# EAGLE design batu (EAGLE 9.2.2)
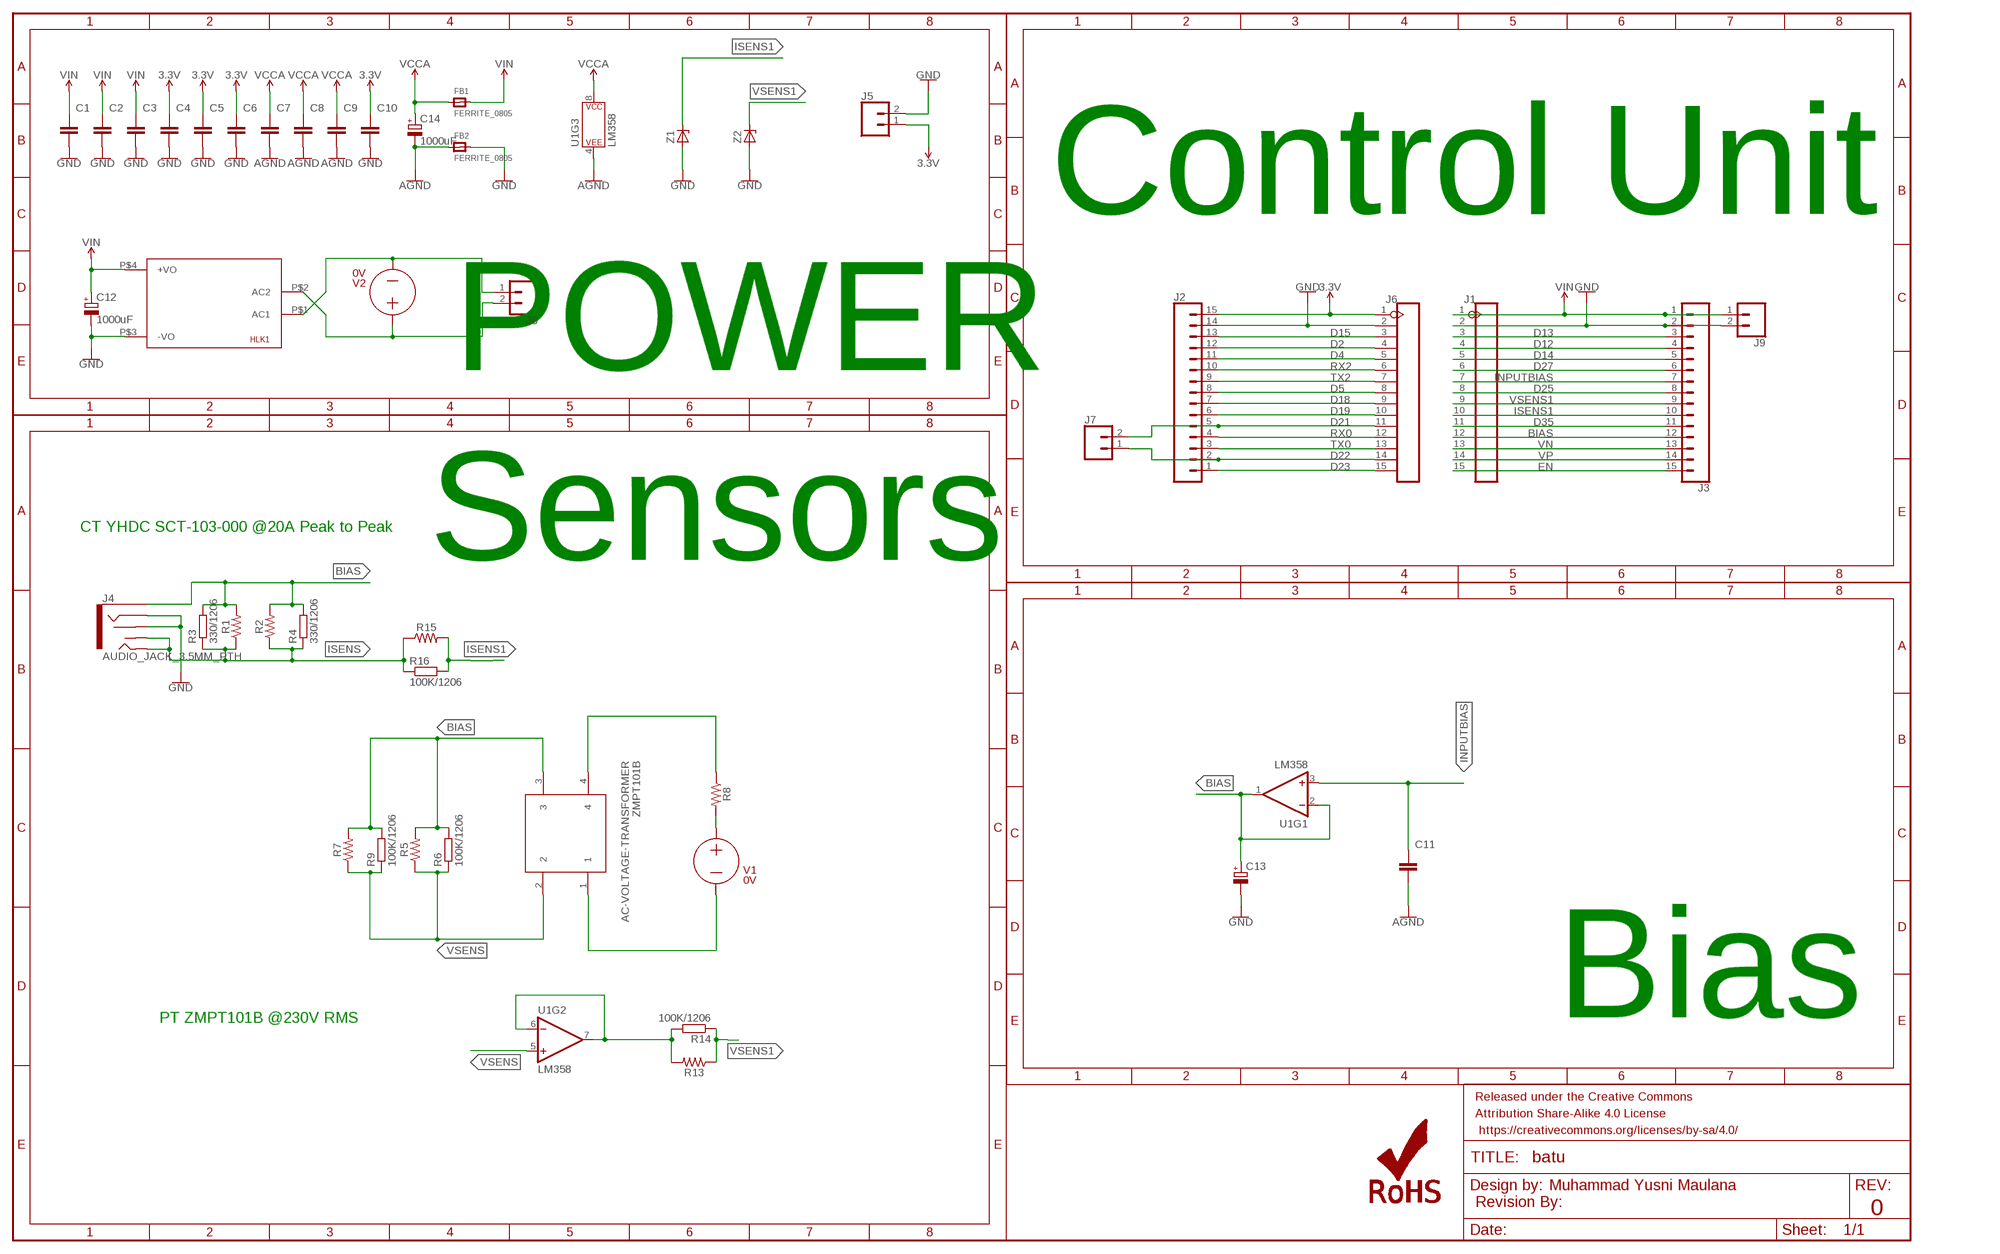
[diagram p0: schematic, sheet 1]

## Parts
C1  0.1uF  C-EUC1206  [C1206]
C2  10uF  C-EUC1206  [C1206]
C3  0.1uF  C-EUC1206  [C1206]
C4  0.1uF  C-EUC1206  [C1206]
C5  10uF  C-EUC1206  [C1206]
C6  0.1uF  C-EUC1206  [C1206]
C7  0.1uF  C-EUC1206  [C1206]
C8  10uF  C-EUC1206  [C1206]
C9  10uF  C-EUC1206  [C1206]
C10  0.1uF  C-EUC1206  [C1206]
C11  10uF  C-EUC1206  [C1206]
C12  1000uF  CPOL-EUSANYO_C6  [SANYO-OSCON_C6]
C13  CPOL-EUSANYO_C6  [SANYO-OSCON_C6]
C14  1000uF  CPOL-EUSANYO_C6  [SANYO-OSCON_C6]
FB1  FERRITE_0805  [_0805]
FB2  FERRITE_0805  [_0805]
FRAME1  FRAME-LEDGER  [CREATIVE_COMMONS]
HLK1  HLK-PM013W  [HLK-PM01]
J1  HEADER-15P2.54  [15P-2.54]
J2  CONN_15  [1X15]
J3  CONN_15  [1X15]
J4  AUDIO_JACK_3.5MM_PTH  [AUDIO-JACK]
J5  CONN_021X02_NO_SILK  [1X02_NO_SILK]
J6  HEADER-15P2.54  [15P-2.54]
J7  CONN_021X02_NO_SILK  [1X02_NO_SILK]
J8  CONN_025MM  [SCREWTERMINAL-5MM-2]
J9  CONN_021X02_NO_SILK  [1X02_NO_SILK]
LOGO3  REVISION  [REVISION]
LOGO8  ROHS_LOGO  [ROHS_LOGO_0.18_IN]
R1  RESISTORAXIAL-0.3  [AXIAL-0.3]
R2  RESISTORAXIAL-0.3  [AXIAL-0.3]
R3  330/1206  R-EU_R1206  [R1206]
R4  330/1206  R-EU_R1206  [R1206]
R5  RESISTORAXIAL-0.3  [AXIAL-0.3]
R6  100K/1206  R-EU_R1206  [R1206]
R7  RESISTORAXIAL-0.3  [AXIAL-0.3]
R8  RESISTORAXIAL-0.3  [AXIAL-0.3]
R9  100K/1206  R-EU_R1206  [R1206]
R13  RESISTORAXIAL-0.3  [AXIAL-0.3]
R14  100K/1206  R-EU_R1206  [R1206]
R15  RESISTORAXIAL-0.3  [AXIAL-0.3]
R16  100K/1206  R-EU_R1206  [R1206]
U1  LM358  LM358KIT  [DIL08]
V1  0V  VOLTAGE  (no package)
V2  0V  VOLTAGE  (no package)
Z1  ZENER-DIODESOD80C  [SOD80C]
Z2  ZENER-DIODESOD80C  [SOD80C]
ZMPT101B  AC-VOLTAGE-TRANSFORMER  AC-VOLTAGE-SENSOR  [AC-VOLTAGE-SENSOR]

## Nets
3.3V: C4.1 C5.1 C6.1 C10.1 J2.15 J5.1 J6.1
AGND: C7.2 C8.2 C9.2 C11.2 C14.- FB2.1 U1.4(P$V-)
BIAS: C13.+ J1.12 J3.12 J4.SLEEVE R1.P$2 R2.P$2 R3.2 R4.2 R5.P$2 R6.2 R7.P$2 R9.2 U1.1(OUT) U1.2(-IN) ZMPT101B.3
D2: J2.12 J6.4
D4: J2.11 J6.5
D5: J2.8 J6.8
D12: J1.4 J3.4
D13: J1.3 J3.3
D14: J1.5 J3.5
D15: J2.13 J6.3
D18: J2.7 J6.9
D19: J2.6 J6.10
D21: J2.5 J6.11 J7.2
D22: J2.2 J6.14 J7.1
D23: J2.1 J6.15
D25: J1.8 J3.8
D27: J1.6 J3.6
D35: J1.11 J3.11
EN: J1.15 J3.15
GND: C1.2 C2.2 C3.2 C4.2 C5.2 C6.2 C10.2 C12.- C13.- FB2.2 HLK1.P$3(-VO) J1.2 J2.14 J3.2 J4.RING J4.RSH J5.2 J6.2 J9.2 Z1.A Z2.A
INPUTBIAS: C11.1 J1.7 J3.7 U1.3(+IN)
ISENS: J4.TIP J4.TSH R1.P$1 R2.P$1 R3.1 R4.1 R15.P$1 R16.1
ISENS1: J1.10 J3.10 R15.P$2 R16.2 Z1.C
L: HLK1.P$2(AC2) J8.2 R8.P$2 V1.+ V2.+
N: HLK1.P$1(AC1) J8.1 V1.- V2.- ZMPT101B.1
N$8: R8.P$1 ZMPT101B.4
RX0: J2.4 J6.12
RX2: J2.10 J6.6
TX0: J2.3 J6.13
TX2: J2.9 J6.7
VCCA: C7.1 C8.1 C9.1 C14.+ FB1.1 U1.8(P$V+)
VIN: C1.1 C2.1 C3.1 C12.+ FB1.2 HLK1.P$4(+VO) J1.1 J3.1 J9.1
VN: J1.13 J3.13
VP: J1.14 J3.14
VSENS: R5.P$1 R6.1 R7.P$1 R9.1 U1.5(+IN) ZMPT101B.2
VSENS1: J1.9 J3.9 R13.P$1 R14.1 Z2.C
VSENS2: R13.P$2 R14.2 U1.6(-IN) U1.7(OUT)

## Notes on the sheet
- Control Unit
- POWER
- Sensors
- CT YHDC SCT-103-000 @20A Peak to Peak
- Bias
- PT ZMPT101B @230V RMS
- Muhammad Yusni Maulana
- 0

## Library data of the parts
C1-C11 = for the universe:C-EU: CAPACITOR, European symbol; SPICEPREFIX: C
C12-C14 = for the universe:CPOL-EU: POLARIZED CAPACITOR, European symbol; SPICEPREFIX: C
FB1 FB2 = for the universe:FERRITE
FRAME1 = for the universe:FRAME-LEDGER: Schematic Frame - Ledger Standard 11x14 US Ledger frame
HLK1 = for the universe:HLK-PM01: Hi-Link Power Supply HLK-PM01 3W Author: Ahmed Said <https://github.com/AhmedSaid/EAGLELibraries>
J1 J6 = for the universe:HEADER-15P: Header 15 Standard 15-pin 0.1" header. Use with straight break away headers (SKU : PRT-00116), right angle break away headers (PRT-00553), swiss pins (PRT-00743), machine pins (PRT-00117), and female headers (PRT-00115).
J2 J3 = for the universe:CONN_15: Multi connection point. Often used as Generic Header-pin footprint for 0.1 inch spaced/style header connections On any of the 0.1 inch spaced packages, you can populate with these: Break Away Headers - Straight <https://www.sparkfun.com/products/116> (PRT-00116) Break Away Male Headers - Right Angle <https://www.sparkfun.com/products/553> (PRT-00553) Female Headers <https://www.sparkfun.com/products/115> (PRT-00115) Break Away Headers - Machine Pin <https://www.sparkfun.com/products/117> (PRT-00117) Break Away Female Headers - Swiss Machine Pin <https://www.sparkfun.com/products/743> (PRT-00743) For SCREWTERMINALS and SPRING TERMINALS visit here: Screw Terimnals on SparkFun.com <https://www.sparkfun.com/search/results?term=Screw+Terminals> (5mm/3.5mm/2.54mm spacing) This device is also useful as a general connection point to wire up your design to another part of your project. Our various solder wires solder well into these plated through hole pads. Hook-Up Wire - Assortment (Stranded, 22 AWG) <https://www.sparkfun.com/products/11375> (PRT-11375) Hook-Up Wire - Assortment (Solid Core, 22 AWG) <https://www.sparkfun.com/products/11367> (PRT-11367) View the entire wire category on our website here <https://www.sparkfun.com/categories/141> Special notes: Molex polarized connector foot print use with SKU : PRT-08231 with associated crimp pins and housings. 1MM SMD Version SKU: PRT-10208 NOTES ON THE VARIANTS LOCK and LOCK_LONGPADS... This footprint was designed to help hold the alignment of a through-hole component (i.e. 6-pin header) while soldering it into place. You may notice that each hole has been shifted either up or down by 0.005 of an inch from it's more standard position (which is a perfectly straight line). This slight alteration caused the pins (the squares in the middle) to touch the edges of the holes. Because they are alternating, it causes a "brace" to hold the component in place. 0.005 has proven to be the perfect amount of "off-center" position when using our standard breakaway headers. Although looks a little odd when you look at the bare footprint, once you have a header in there, the alteration is very hard to notice. Also,if you push a header all the way into place, it is covered up entirely on the bottom side.
J4 = for the universe:AUDIO_JACK_3.5MM: Audio Jack 3.5mm variants of PTH and SMT stereo audio jack with bypass switches. SparkFun Products: SparkFun SparkPunk Sound Kit <[https://www.sparkfun.com/products/11177]> - PTH MP3 Trigger <https://www.sparkfun.com/products/13720> -3.5mm SMD SparkFun PicoBoard <https://www.sparkfun.com/products/11888>- 2.5mm SMD; PROD_ID: CONN-08774; SF_ID: PRT-08032
J5 J7 J9 = for the universe:CONN_02: Multi connection point. Often used as Generic Header-pin footprint for 0.1 inch spaced/style header connections On any of the 0.1 inch spaced packages, you can populate with these: Break Away Headers - Straight <https://www.sparkfun.com/products/116> (PRT-00116) Break Away Male Headers - Right Angle <https://www.sparkfun.com/products/553> (PRT-00553) Female Headers <https://www.sparkfun.com/products/115> (PRT-00115) Break Away Headers - Machine Pin <https://www.sparkfun.com/products/117> (PRT-00117) Break Away Female Headers - Swiss Machine Pin <https://www.sparkfun.com/products/743> (PRT-00743) For SCREWTERMINALS and SPRING TERMINALS visit here: Screw Terimnals on SparkFun.com <https://www.sparkfun.com/search/results?term=Screw+Terminals> (5mm/3.5mm/2.54mm spacing) This device is also useful as a general connection point to wire up your design to another part of your project. Our various solder wires solder well into these plated through hole pads. Hook-Up Wire - Assortment (Stranded, 22 AWG) <https://www.sparkfun.com/products/11375> (PRT-11375) Hook-Up Wire - Assortment (Solid Core, 22 AWG) <https://www.sparkfun.com/products/11367> (PRT-11367) View the entire wire category on our website here <https://www.sparkfun.com/categories/141> Special notes: Molex polarized connector foot print use with: PRT-08233 with associated crimp pins and housings. 2.54_SCREWTERM for use with PRT-10571. 3.5mm Screw Terminal footprints for PRT-08084 5mm Screw Terminal footprints for use with PRT-08432
J8 = for the universe:CONN_02: Multi connection point. Often used as Generic Header-pin footprint for 0.1 inch spaced/style header connections On any of the 0.1 inch spaced packages, you can populate with these: Break Away Headers - Straight <https://www.sparkfun.com/products/116> (PRT-00116) Break Away Male Headers - Right Angle <https://www.sparkfun.com/products/553> (PRT-00553) Female Headers <https://www.sparkfun.com/products/115> (PRT-00115) Break Away Headers - Machine Pin <https://www.sparkfun.com/products/117> (PRT-00117) Break Away Female Headers - Swiss Machine Pin <https://www.sparkfun.com/products/743> (PRT-00743) For SCREWTERMINALS and SPRING TERMINALS visit here: Screw Terimnals on SparkFun.com <https://www.sparkfun.com/search/results?term=Screw+Terminals> (5mm/3.5mm/2.54mm spacing) This device is also useful as a general connection point to wire up your design to another part of your project. Our various solder wires solder well into these plated through hole pads. Hook-Up Wire - Assortment (Stranded, 22 AWG) <https://www.sparkfun.com/products/11375> (PRT-11375) Hook-Up Wire - Assortment (Solid Core, 22 AWG) <https://www.sparkfun.com/products/11367> (PRT-11367) View the entire wire category on our website here <https://www.sparkfun.com/categories/141> Special notes: Molex polarized connector foot print use with: PRT-08233 with associated crimp pins and housings. 2.54_SCREWTERM for use with PRT-10571. 3.5mm Screw Terminal footprints for PRT-08084 5mm Screw Terminal footprints for use with PRT-08432; SF_SKU: PRT-08432
LOGO3 = SparkFun-Aesthetics:REVISION: "Revision By" Text Preceding text for revisor documentation. Includes schematic text on "symbols" layer, and board text on tDoc.
LOGO8 = for the universe:ROHS_LOGO: Restriction of Hazardous Substances (RoHS) Logo Logo for RoHS-certified hardware.
R1 R2 R5 R7 R8 R13 R15 = for the universe:RESISTOR: Generic Resistor Package
R3 R4 R6 R9 R14 R16 = for the universe:R-EU_: RESISTOR, European symbol; SPICEPREFIX: R
U1 = for the universe:LM358: LM358 Jellybean op-amp Datasheet <http://www.sparkfun.com/datasheets/Components/General/LM358.pdf> SparkFun Products Op-Amp (Thru-Hole) - LM358 <https://www.sparkfun.com/products/9456> (COM-09456); PROD_ID: IC-09172; SPICEPREFIX: U
V1 V2 = for the universe:VOLTAGE: Independent Voltage Source, either DC, AC, PULSE, SINE, PWL, EXP, or SFFM
Z1 Z2 = for the universe:ZENER-DIODE: Z-Diode
ZMPT101B = for the universe:AC-VOLTAGE-SENSOR: ZMPT101B transformer

## Net classes
0 default: clearance 0.3 mm

## Board
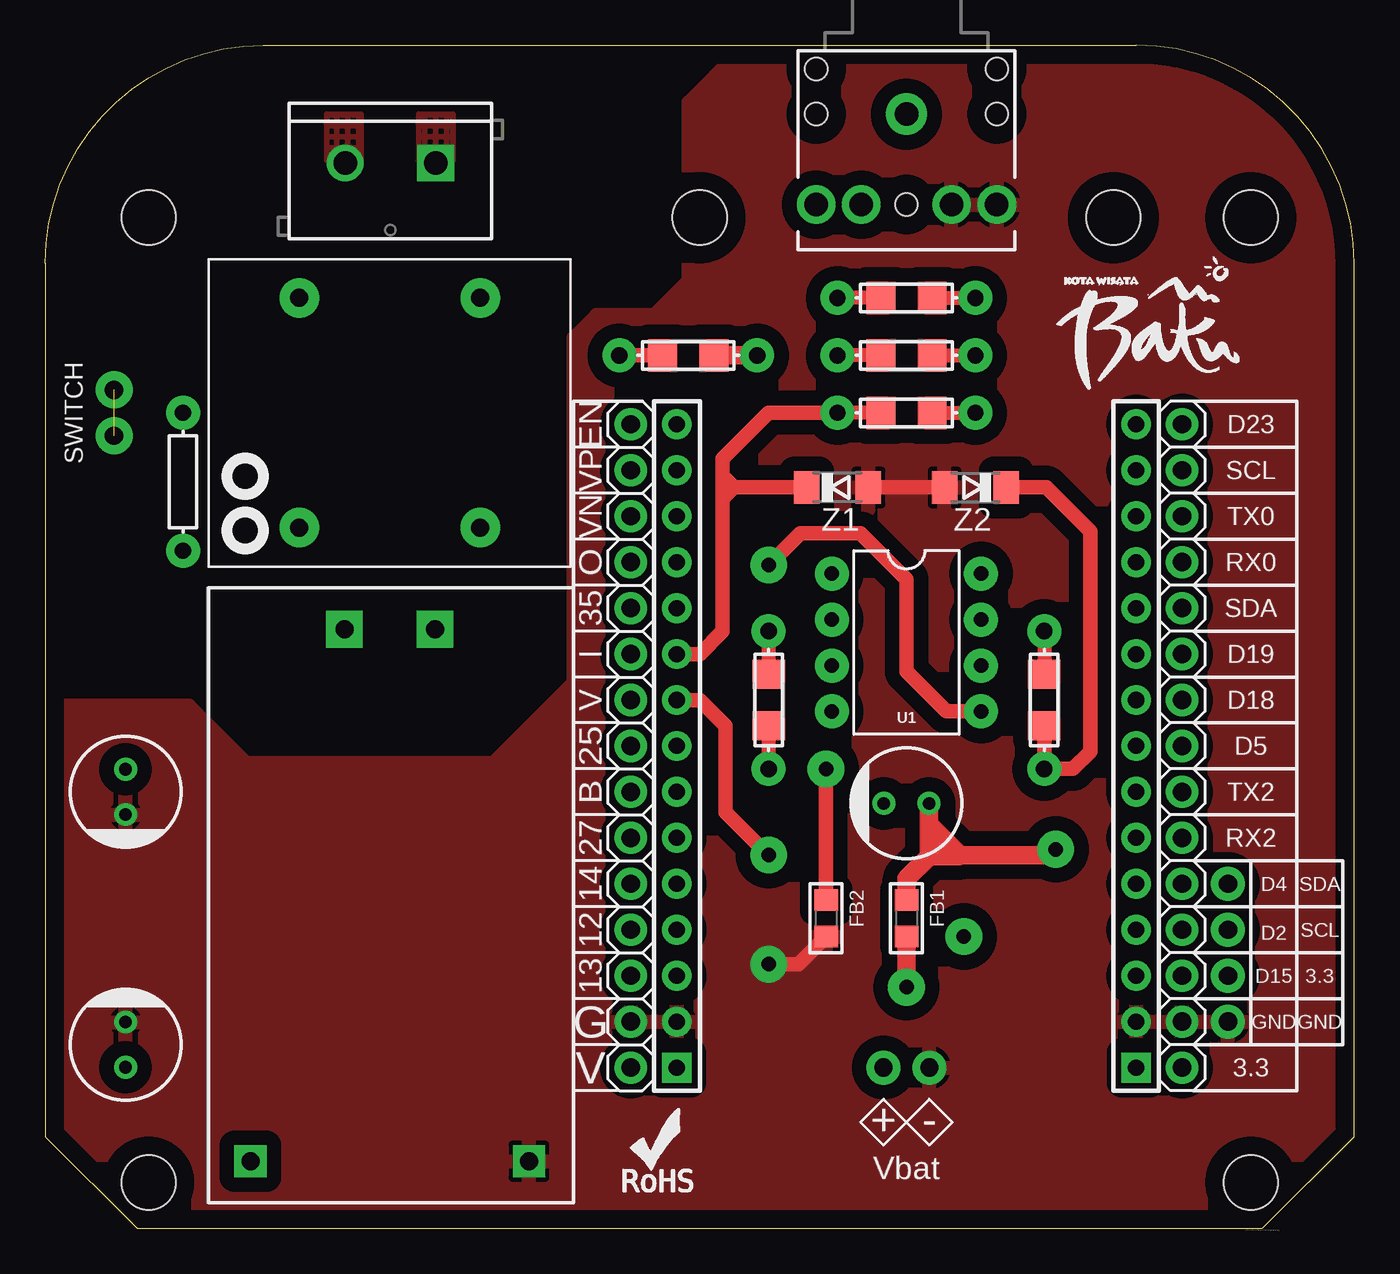
[diagram p1: board, top side]
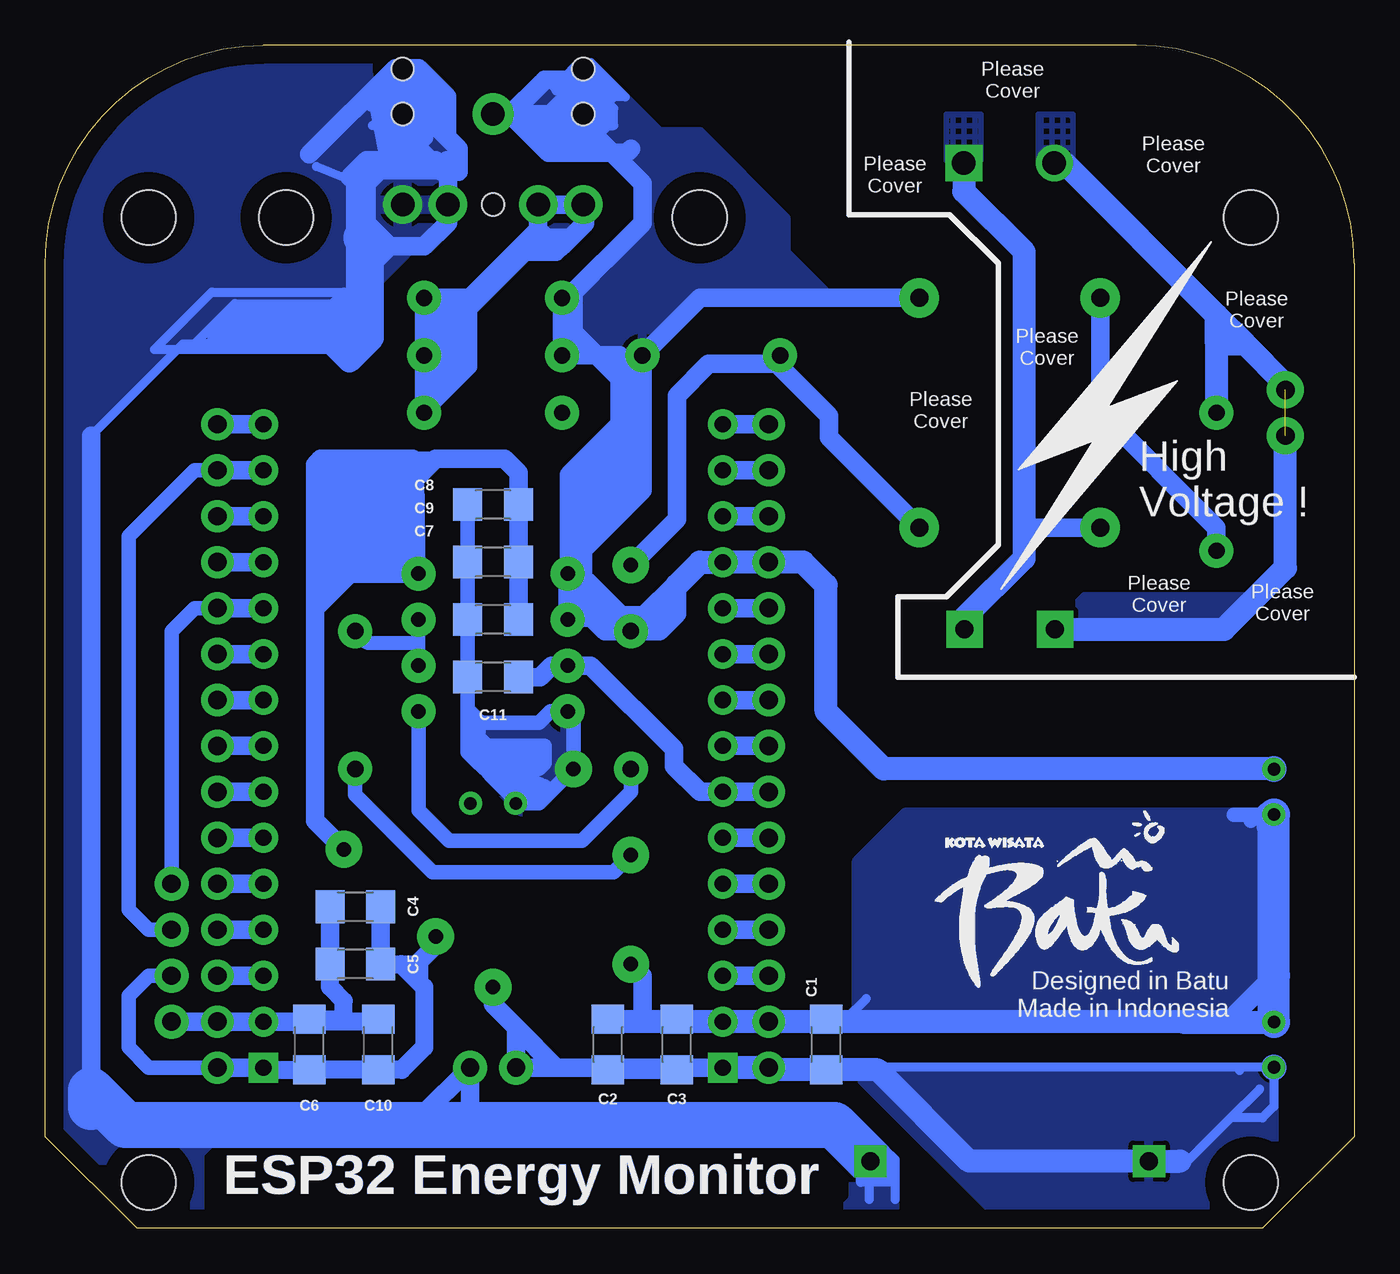
[diagram p2: board, bottom side, seen from below]

Size 72.39 x 65.41 mm. Coordinates in mm from the lower left corner, seen from the top.
Outline: 0,53.34 0,5.08 5.08,0 67.31,0 72.39,5.08 72.39,53.34 arc90 60.33,65.41 12.07,65.41 arc90 0,53.34
Copper layers (1*16): Top 0.035mm / dielectric 1.5mm / Bottom 0.035mm
Design rules "default *": minimum track width 6mil, minimum drill 0.35mm, track to track 6mil, track to pad 6mil, pad to pad 6mil, via to via 6mil, smd to smd 6mil, copper to edge 40mil, drill to drill 6mil, minimum pad ring 10mil, minimum via ring 8mil, stop-mask expansion 4mil, vias tented up to drill 0mil, thermal gap 10mil
Holes 3 mm at 66.67,2.54 5.72,2.54 5.72,55.88 36.2,55.88 59.05,55.88 66.67,55.88

### Footprints (pad centres in the part's own frame; a part is rotated, then mirrored left to right if it is on the bottom)
C1206 = smd 1.6 x 1.8: 1 -1.4,0; 2 1.4,0
SANYO-OSCON_C6 = drill 0.7 pad 1.27: + 1.25,0; - -1.25,0
_0805 = smd 1.2 x 1.3: 1 -1.016,0; 2 1.016,0
HLK-PM01 = drill 1 pad 2.032 square: P$1 -14.7,2.5; P$2 -14.7,-2.5 | drill 1 pad 1.778 square: P$3 14.7,7.7; P$4 14.7,-7.7
15P-2.54 = drill 0.889 pad 1.651 square: 1 -17.78,0 | drill 0.889 pad 1.651: 2 -15.24,0; 3 -12.7,0; 4 -10.16,0; 5 -7.62,0; 6 -5.08,0; 7 -2.54,0; 8 0,0; 9 2.54,0; 10 5.08,0; 11 7.62,0; 12 10.16,0; 13 12.7,0; 14 15.24,0; 15 17.78,0
1X15 = drill 1.016 pad 1.778: 1 0,0; 2 2.54,0; 3 5.08,0; 4 7.62,0; 5 10.16,0; 6 12.7,0; 7 15.24,0; 8 17.78,0; 9 20.32,0; 10 22.86,0; 11 25.4,0; 12 27.94,0; 13 30.48,0; 14 33.02,0; 15 35.56,0
AUDIO-JACK = drill 1.3 pad 2.134: RING 5,5; RSH 5,2.5; TIP 5,-5; TSH 5,-2.5 | drill 1.3 pad 2.286: SLEEVE 0,0 | hole 1.25: 0,5; -2.5,5; -2.5,-5; 0,-5; 5,0
1X02_NO_SILK = drill 1.016 pad 1.88: 1 0,0; 2 2.54,0
SCREWTERMINAL-5MM-2 = drill 1.3 pad 2.032 square: 1 0,0 | drill 1.3 pad 2.032: 2 5,0
AXIAL-0.3 = drill 0.9 pad 1.88: P$1 -3.81,0; P$2 3.81,0
R1206 = smd 1.6 x 1.803: 1 -1.422,0; 2 1.422,0
DIL08 = drill 0.813 pad 1.88: 1 -3.81,-4.128; 2 -1.27,-4.128; 3 1.27,-4.128; 4 3.81,-4.128; 5 3.81,4.128; 6 1.27,4.128; 7 -1.27,4.128; 8 -3.81,4.128
SOD80C = smd 1.4 x 1.8: A 1.7,0; C -1.7,0
AC-VOLTAGE-SENSOR = drill 1 pad 2.184: 1 5,6.35; 2 -5,6.35; 3 -5,-6.35; 4 5,-6.35

### Placement (x,y rotation side)
C1  29.21,10.16 90 bottom
C2  41.28,10.16 90 bottom
C3  37.47,10.16 90 bottom
C4  55.25,17.78 180 bottom
C5  55.25,14.61 180 bottom
C6  57.79,10.16 90 bottom
C7  47.62,33.66 180 bottom
C8  47.62,40.01 180 bottom
C9  47.62,36.83 180 bottom
C10  53.98,10.16 90 bottom
C11  47.62,30.48 180 bottom
C12  4.45,10.16 270 top
C13  4.45,24.13 90 top
C14  47.62,23.5 0 top
FB1  47.62,17.14 270 top
FB2  43.18,17.14 270 top
FRAME1  14.29,-25.08 0 top  (outside the outline)
HLK1  19.05,18.41 270 top
J1  34.93,26.67 90 top
J2  62.87,44.45 270 top
J3  32.39,8.89 90 top
J4  47.62,61.59 270 top
J5  65.41,13.97 270 top
J6  60.33,26.67 90 top
J7  65.41,16.51 90 top
J8  21.59,58.9 180 top
J9  46.36,8.89 0 top
LOGO3  26.67,-27.94 0 top  (outside the outline)
LOGO8  31.75,1.91 0 top
R1  47.62,51.44 180 top
R2  47.62,48.26 180 top
R3  47.62,51.44 180 top
R4  47.62,48.26 180 top
R5  40.01,29.21 90 top
R6  40.01,29.21 90 top
R7  35.56,48.26 0 top
R8  7.62,41.27 90 top
R9  35.56,48.26 0 top
R13  55.25,29.21 90 top
R14  55.25,29.21 90 top
R15  47.62,45.09 180 top
R16  47.62,45.09 180 top
U1  47.62,32.38 270 top
Z1  43.81,40.96 0 top
Z2  51.44,40.96 180 top
ZMPT101B  19.05,45.09 180 top

### Tracks (layer width: path | path; a pad name or v marks a point on that pad's centre or on a via)
3.3V  (via drill 0.8 pad 2.03)
  Bottom 0.508: 51.44,13.34 51.44,15.03 51.33,15.13 | J6.1 60.2,8.76 58.42,8.76
  Bottom 0.762: 57.92,8.89 C6.1
  Bottom 0.813: J2.15 66.67,8.89 67.79,10 67.79,12.86 66.67,13.97 J5.1
  Bottom 1: v50.8,16.14 50.56,15.9 51.33,15.13 51.86,14.61 C5.1 52.7,14.61 51.44,13.34 51.44,10 52.68,8.76 C10.1 C6.1 58.42,8.76 60.33,8.76
  Bottom 1.016: C4.1 C5.1 | J2.15 60.45,8.89 60.33,8.76
AGND  (via drill 0.8 pad 2.03)
  Top 0.813: FB2.1 v43.18,25.4
  Bottom 0.813: C8.2 C9.2 C7.2 C11.2 49.03,28.7 | 43.43,25.65 v43.18,25.4 | 48.58,28.26 48.26,27.94 45.09,27.94 44.45,28.57 U1.4 43.18,28.32 v43.18,25.4 | 48.58,28.26 49.03,28.7 | 45.72,25.4 45.09,25.4 44.77,25.72 44.77,26.35 | 45.72,25.4 48.1,25.4 | 48.1,25.4 48.58,25.88 | 48.58,25.88 49.03,26.32 49.03,28.7 | v43.18,25.4 43.18,27.05 | 44.77,26.35 45.4,25.72 | 45.4,25.72 45.72,25.4 | 48.58,28.26 48.58,27.3 | 48.58,27.3 48.58,26.04 | 48.58,26.04 48.58,25.88 | 45.4,25.72 45.72,25.72 45.4,26.04 | 48.58,26.04 45.4,26.04 | 45.4,26.04 44.77,26.67 | 48.42,27.46 48.58,27.3 | 48.58,27.3 47.94,26.67 44.77,26.67 | 44.77,26.67 44.77,26.35 | v43.18,25.4 45.09,23.5 46.2,23.5 47.15,24.45 | 47.15,24.45 45.09,24.45 | 47.15,24.45 47.78,25.08 | 47.78,25.08 48.1,25.4 | 47.78,25.08 45.72,25.08 45.09,24.45 | 45.09,24.45 44.77,24.45
  Bottom 1.016: C14.- 45.42,24.45 45.09,24.45
  pour Bottom (isolate 0.279): 43.5,28.57 44.45,28.57 45.09,27.94 48.58,27.94 48.58,26.67 46.99,25.08 46.99,24.13 46.04,23.18 43.18,26.04 43.18,28.26
BIAS
  Top 0.762: R5.P$2 R6.2 | R3.2 R1.P$2 | R4.2 R2.P$2
  Top 1.016: R9.2 R7.P$2
  Bottom 0.508: 41.91,63.5 41.91,64.14 | 41.91,64.14 43.18,64.14 43.18,63.5 43.81,63.5 | 41.91,64.14 40.96,63.18 | 40.96,63.18 40.32,62.55 40.93,62.55 | 41.23,62.84 40.93,62.55 | 43.81,61.59 43.18,62.23 | 42.86,62.55 42.23,63.18 40.96,63.18 | 43.18,62.23 42.86,62.55 | 42.86,62.55 40.93,62.55 | 41.28,62.23 41.25,62.23 40.93,62.55 | 43.18,62.23 41.28,62.23 | 41.28,62.23 40.96,61.91 | 40.96,61.91 41.28,61.59 | 41.28,61.59 41.28,61.28 41.91,60.64 | 41.91,60.33 41.28,60.96 40.96,60.96 40.96,61.91 | 41.91,61.91 41.59,61.91 41.28,61.59 | 43.81,63.5 44.45,63.5 | 44.45,63.5 44.5,63.5 | 44.5,63.5 44.77,63.5 44.93,63.34 | 41.91,64.14 42.23,64.45 42.86,64.45 43.81,63.5 | 43.81,62.87 44.13,62.87 44.13,62.96 44.5,63.32 | 44.5,63.32 44.5,63.5 | 44.5,63.32 43.64,63.32 43.18,62.87 43.81,62.87 | 44.45,63.5 43.81,62.87
  Bottom 0.813: 42.86,40.32 42.86,38.1 42.55,38.1 40.32,40.32 | 42.55,39.05 42.55,40.64 42.39,40.8 | 42.55,39.05 42.55,36.83 | R5.P$2 40.32,33.34 | 40.64,33.66 41.91,33.66 | 41.91,33.66 42.07,33.66 U1.2 | 41.91,33.66 42.55,34.29 | 42.55,34.29 43.18,34.92 | 43.18,34.92 43.5,35.24 43.5,35.56 | 42.55,36.83 43.18,36.2 43.18,34.92 | 42.55,36.83 42.55,35.72 42.55,34.29 | 40.32,40.32 40.32,40.64 | 40.32,40.64 40.32,40.96 | 40.32,40.96 40.32,41.59 | 40.32,41.59 40.32,44.77 | 40.32,44.77 40.01,45.09 40.01,40.64 | 40.32,40.64 41.91,39.05 42.55,39.05 | 42.86,39.05 40.96,40.96 | 40.96,40.96 40.32,40.96 | 40.96,40.96 40.32,41.59 | 40.01,40.64 40.32,40.32 | 40.32,44.77 40.32,47.31 R7.P$2 39.37,41.27 40.01,40.64
  Bottom 1.016: 42.11,52.83 43.18,51.75 | 43.18,51.75 43.81,51.12 R1.P$2 | U1.2 43.5,35.56 U1.1 | U1.1 43.43,36.83 43.43,38.48 | 43.43,38.48 42.86,39.05 42.86,40.32 42.39,40.8 40.64,42.55 40.64,43.81 | 40.64,44.45 40.64,45.09 | 40.64,45.09 40.64,46.99 41.91,48.26 | 40.64,43.81 40.64,44.45 | 43.43,38.48 43.43,41.02 | 43.43,41.02 40.64,43.81 | 43.43,41.02 43.43,41.66 40.64,44.45 | U1.1 42.86,36.79 42.86,37.31 | 42.86,38.73 42.86,38.1 42.86,37.31 | R2.P$2 R1.P$2 | R2.P$2 43.18,48.9 43.18,49.53 | 43.18,49.53 43.18,51.75 | 43.18,48.26 R2.P$2 | R2.P$2 41.91,48.26 | 40.32,45.4 40.64,45.09 | 40.64,44.45 40.01,45.09 40.01,47.62 40.64,48.26 41.91,48.26 | 43.18,49.53 41.91,48.26 | C13.+ 4.47,25.4 | 41.28,59.69 39.37,57.78 39.37,55.56 43.58,51.35 43.73,51.35 R1.P$2 | 41.91,59.69 42.55,59.69 | 42.55,59.69 43.18,59.69 | 43.18,59.69 43.81,59.69 44.13,60.01 | 41.91,59.69 41.28,59.69 | 43.18,63.5 42.55,63.5 | 42.55,63.5 41.91,63.5 41.91,61.91 41.91,60.64 41.91,59.69 | 44.13,60.01 45.72,61.59 | 42.55,63.5 42.55,60.33 | 42.55,60.33 42.55,59.69 | 43.18,59.69 43.18,62.23 43.18,62.87 43.18,63.5 | 44.13,60.01 43.81,60.33 43.81,61.59 43.81,62.23 44.77,61.28 | 45.72,61.59 44.77,61.59 44.77,60.96 | 45.72,61.59 46.67,61.59 | 41.28,59.69 41.91,60.33 42.55,60.33 | ZMPT101B.3 36.2,51.44 R7.P$2 39.37,40.8 42.86,37.31 | 46.67,61.59 44.55,59.47 40.22,59.47 40.01,59.69 | J4.SLEEVE 46.67,61.59 | 46.67,61.59 44.93,63.34 | 44.77,63.5 43.18,63.5 | 37.47,34.61 37.47,33.97 37.78,33.66 | 37.47,34.61 37.47,35.56 | R5.P$2 41.43,33.02 42.07,33.66 | 42.55,34.29 41.28,34.29 | 41.28,34.29 40.88,33.89 | 40.88,33.89 R5.P$2 | R5.P$2 38.42,33.02 37.78,33.66 | 41.28,34.29 43.18,36.2 | 40.88,33.89 39.13,33.89
  Bottom 1.016: 37.78,33.66 38.02,33.89 38.18,33.89 37.47,34.61 | R5.P$2 40.01,33.18
  Bottom 1.27: 4.47,25.4 26.04,25.4 29.21,28.57 29.21,35.56 30.48,36.83 J3.12 J1.12 36.2,36.83 37.47,35.56 39.13,33.89 | 40.01,33.18 42.55,35.72
  Bottom 1.397: C13.+ 4.45,25.4
  pour Bottom (isolate 0.508): 41.91,64.14 38.42,60.64 36.2,60.64 31.43,55.88 31.43,53.98 28.89,51.44 36.2,51.44 39.37,48.26 43.18,48.26 43.18,52.07 39.37,55.88 39.37,57.47 41.91,60.01
  pour Bottom: 44.77,63.5 46.04,62.23 46.04,61.91 44.45,61.91 44.13,62.23 44.13,63.5
D2
  Bottom 1.016: J6.4 J2.12
D4
  Bottom 1.016: J2.11 J6.5
D5
  Bottom 1.016: J2.8 J6.8
D12
  Bottom 1.016: J3.4 J1.4
D13
  Bottom 1.016: J1.3 J3.3
D14
  Bottom 1.016: J3.5 J1.5
D15
  Bottom 1.016: J2.13 J6.3
D18
  Bottom 1.016: J2.7 J6.9
D19
  Bottom 1.016: J2.6 J6.10
D21
  Bottom 0.813: J7.2 65.41,33.02 64.14,34.29 J2.5
  Bottom 1.016: J2.5 J6.11
D22
  Bottom 0.813: J7.1 66.67,16.51 67.79,17.62 67.79,38.26 64.14,41.91 J2.2
  Bottom 1.016: J2.2 J6.14
D23
  Bottom 1.016: J2.1 J6.15
D25
  Bottom 1.016: J3.8 J1.8
D27
  Bottom 1.016: J3.6 J1.6
D35
  Bottom 1.016: J3.11 J1.11
EN
  Bottom 1.016: J3.15 J1.15
GND  (via drill 0.8 pad 2.03)
  Top 0.813: FB2.2 41.66,14.61 v40.01,14.61 | Z2.A Z1.A
  Bottom 0.508: 53.34,62.23 53.76,61.81 53.98,61.59 53.98,61.28 | 53.71,61.54 53.98,61.28 | 54.29,60.96 53.98,61.28 | 53.98,61.28 53.34,61.28 | 57.39,58.71 55.88,58.1 | 55.25,57.78 54.77,58.26 54.45,58.58 53.98,59.05 | 50.8,58.5 52.07,59.05 | 50.17,57.15 50.12,57.15 | 51.44,63.18 52.39,63.18 | 49.53,5.71 50.17,5.71 50.8,6.35 50.96,6.19 51.59,6.19 52.23,6.19 | 69.85,7.62 69.22,7.62 | 69.22,7.62 67.31,5.71 | 69.22,7.62 68.9,7.62 66.99,5.71 | 25.4,2.54 26.58,3.71 HLK1.P$3 26.83,3.8 | 25.4,2.54 27.3,2.54 27.3,2.86 | 27.39,4.36 25.95,4.36 25.4,3.81 25.4,2.54 | 25.4,2.54 25.4,1.59 | 26.83,3.8 26.83,4.58 27.07,4.82 28.58,4.82 | 26.83,3.8 26.83,1.59 | 55.88,48.58 66.36,48.58 63.18,51.75 55.88,51.75 55.88,51.12 | 55.88,51.12 55.88,49.21 56.2,48.9 56.52,48.9 64.14,48.9 | 64.14,48.9 61.91,51.12 55.88,51.12 | 55.88,51.12 56.2,50.8 56.2,49.21 63.18,49.21 62.87,49.53 | 62.87,49.53 61.59,50.8 56.52,50.8 56.52,49.53 62.23,49.53 | 62.87,49.53 62.23,49.53 | 62.23,49.53 61.91,49.85 | 61.59,50.16 61.28,50.48 57.15,50.48 56.83,50.16 | 56.83,50.16 56.83,50.8 56.2,51.44 | 56.83,50.16 56.83,49.85 61.91,49.85 | 61.59,50.16 61.91,49.85 | 56.83,50.16 61.59,50.16 | C1.2 28.13,11.56 26.99,12.7 | 69.85,43.81 64.77,48.9 64.14,48.9
  Bottom 0.61: 53.02,63.5 53.02,63.82
  Bottom 0.762: C10.2 54.11,11.43 | 57.28,11.43 57.92,11.43 | C1.2 29.34,11.43 | 41.28,11.43 C2.2
  Bottom 0.813: J5.2 J2.14 J6.2 | 5.72,22.54 5.38,22.88 C13.- 6.65,22.88 6.67,22.86
  Bottom 1: 37.47,11.43 C3.2 | 54.11,11.43 57.28,11.43 | 29.34,11.43 J3.2 | C6.2 55.88,11.56 55.88,12.57 56.65,13.34 C5.2
  Bottom 1.016: 52.23,6.19 52.7,5.71 53.02,5.71 66.99,5.71 67.31,5.71 67.95,5.71 | C5.2 C4.2 | 48.26,6.35 48.26,5.86 | 48.26,5.86 48.26,5.71 | C12.- 6.63,11.41 6.65,11.43 5.08,11.43 | J4.RSH 50.12,57.15 50.12,57.83 | 53.34,59.05 53.98,59.05 54.61,59.05 55.25,58.42 | 69.85,6.71 69.85,43.81 | 53.34,59.05 52.7,59.05 | 52.7,59.05 52.07,59.05 | 52.07,59.05 50.8,59.05 50.8,58.5 54.37,58.5 | 53.34,62.23 53.34,61.28 | 53.34,61.28 53.34,59.69 53.34,59.05 | 52.07,59.05 52.07,60.33 | 52.07,60.33 52.07,63.5 51.75,63.5 52.39,64.14 | 52.7,59.05 52.7,63.5 53.02,63.5 | 55.25,58.42 55.25,57.78 55.25,57.15 | 55.25,56.2 55.25,54.93 | 54.61,53.98 54.29,53.66 54.29,53.34 | 54.61,53.98 55.25,54.61 55.25,49.21 | 54.29,53.98 54.61,53.98 | 54.29,53.34 54.29,50.16 54.61,49.85 55.25,49.21 | 55.25,49.21 55.88,48.58 | 55.56,58.1 55.25,58.42 | 4.45,13.97 6.98,11.43 | 9.53,11.43 9.51,11.41 | C13.- 4.76,22.56 | 57.92,11.43 J5.2 | 53.02,64.14 53.02,63.5 | 53.02,63.5 54.29,62.23 | 53.02,64.14 57.79,59.37 | 52.39,63.18 52.39,64.14 | J4.RSH 50.12,59.02 50.17,59.05 | J4.RSH 50.12,55.6 51.44,54.29 53.34,54.29 | 54.61,55.56 53.34,54.29 | 54.61,55.56 55.25,56.2 | 55.25,56.2 55.25,57.15 | 55.25,57.15 53.34,59.05 | 54.37,58.5 54.45,58.58 | 54.61,58.26 54.77,58.26 | 54.37,58.5 54.61,58.26 | 54.61,58.26 54.61,55.56 | 53.34,54.29 54.29,53.34 | 53.02,64.14 52.39,64.14 | 52.39,64.14 51.75,64.14 51.44,63.82 | 53.34,61.28 50.48,58.42 49.53,58.42 49.53,59.69 50.17,60.33 | 52.07,60.33 51.44,60.33 51.44,61.59 | 50.17,60.33 50.64,60.8 | 50.64,60.8 51.44,61.59 | 51.44,61.59 51.44,63.82 | 50.64,60.8 50.64,63.02 | 50.64,63.02 51.44,63.82 | 50.17,60.33 50.17,62.55 50.64,63.02 | v40.01,14.61 39.37,13.97 39.37,11.43
  Bottom 1.016: 48.26,5.86 48.4,5.86 48.9,6.35 J9.2 51.59,6.19 51.93,5.86 53.02,5.86
  Bottom 1.27: 41.28,11.43 39.37,11.43 37.47,11.43 J1.2 J3.2 9.53,11.43 6.65,11.43 | 9.51,11.41 C12.- | 4.76,22.56 4.76,22.23 | C6.2 57.92,11.43 | 53.34,59.69 53.71,61.54 53.76,61.81 | 56.52,48.9 55.56,47.94 54.29,49.21 54.29,53.34 54.29,53.98 | 54.29,53.98 54.61,53.66 54.61,49.85 | 54.29,53.66 55.25,54.61 55.25,54.93 54.29,53.98
  Bottom 1.397: C12.- 4.45,11.43 | 4.76,22.86 4.47,22.86 C13.-
  Bottom 1.778: C12.- 4.45,13.97 C13.-
  Bottom 2.54: HLK1.P$3 27.39,4.36 28.75,5.71 48.26,5.71 49.53,5.71 53.02,5.71 67.95,5.71 69.85,7.62 69.85,6.71
  pour Bottom (isolate 0.508): 4.52,22.86 24.77,22.86 27.38,20.24 27.38,11.59 6.83,11.59 4.37,14.05 4.37,22.7
  pour Bottom (isolate 0.508): 49.53,58.42 49.53,59.69 54.61,64.77 72.71,64.77 74.93,62.55 74.93,0 63.82,-0.32 63.82,4.13 63.18,4.76 32.39,4.76 27.62,0 25.4,0 25.4,3.81 27.62,6.03 67.95,6.03 69.85,7.94 69.85,43.81 62.23,51.44 56.52,51.44 55.88,52.07 55.88,56.52 55.25,57.15 55.25,58.42 54.61,59.05 50.8,59.05 50.17,58.42
  pour Bottom: 56.2,48.58 65.09,48.58 61.91,51.75 61.91,52.39 55.88,52.39 55.88,48.58
  pour Bottom: 53.98,62.55 53.98,60.64 54.29,60.64 54.29,62.55
  pour Bottom: 49.85,6.67 51.75,6.67 51.75,6.35 52.07,6.03 50.48,6.03
  pour Bottom (isolate 0.254): 54.29,52.39 52.39,54.29 51.44,54.29 50.17,55.56 50.17,58.74 50.48,59.05 54.93,59.05 55.88,58.1 55.88,52.07 55.56,52.39
  pour Top (isolate 0.813): -10.16,29.85 -10.16,-17.78 89.22,-17.78 89.22,68.9 87.31,70.8 39.37,70.8 38.42,69.85 38.42,65.09 35.56,62.23 35.56,52.39 33.66,50.48 30.48,50.48 29.21,49.21 29.21,30.16 24.77,25.72 11.11,25.72 7.94,28.89 -9.21,28.89
INPUTBIAS
  Bottom 0.762: U1.3 43.56,31.25
  Bottom 1.016: C11.1 45.02,30.48 44.39,31.11 U1.3 42.23,31.11 37.62,26.51 37.62,25.56 36.2,24.13 J1.7 J3.7
ISENS
  Top 0.762: R3.1 R1.P$1 | R4.1 R2.P$1 | R16.1 R15.P$1
  Bottom 0.508: J4.TIP 42.62,55.64 42.55,55.56
  Bottom 0.813: R15.P$1 49.69,46.83 | 49.69,46.83 48.9,47.62 | 48.9,47.62 48.9,48.26 | 48.9,48.26 48.9,49.05 | 48.9,49.05 48.9,50.8 | 48.9,50.8 48.9,51.44 | R2.P$1 49.85,48.26 | 49.85,48.26 49.53,48.26 | 49.53,48.26 48.9,48.26 | 48.9,50.8 49.05,50.8 49.69,51.44 49.69,50.64 | 48.9,49.05 49.53,48.42 49.53,48.26 | 49.53,48.26 48.9,47.62 | 48.9,47.62 49.21,47.62 49.85,48.26 | 49.85,48.26 49.69,48.42 | 49.69,48.42 49.69,49.69 | 49.69,49.69 49.69,50.64 | 49.69,47.78 49.69,46.83 | 51.44,46.04 49.69,47.78 | 49.69,47.78 49.69,48.42 | 51.12,49.69 51.44,50.01 50.17,51.28 | 51.12,49.69 50.64,49.69 | 50.64,49.69 49.69,49.69 | 49.69,47.78 51.12,49.21 51.12,49.53 | 51.44,46.99 50.01,48.42 | 50.01,48.42 49.69,48.42 | 49.85,48.26 51.12,49.53 | 51.12,49.53 51.12,49.69 | 50.01,48.42 50.01,50.32 49.69,50.64 | 50.17,51.28 50.17,51.44 | 50.17,51.28 50.17,50.16 50.64,49.69 | 48.9,50.8 45.72,53.98 45.4,53.98
  Bottom 1.016: R15.P$1 51.44,46.04 51.44,46.99 R2.P$1 51.44,50.01 R1.P$1 50.17,51.44 49.69,51.44 48.9,51.44 46.36,53.98 | 42.55,56.95 42.55,55.56 43.34,54.77 | 43.34,54.77 43.81,54.29 | 43.81,54.29 44.13,53.98 45.4,53.98 46.36,53.98 | 43.81,54.29 44.45,54.29 45.12,54.97 45.12,55.2 | 42.59,56.59 J4.TIP J4.TSH 45.12,55.2 | 45.12,55.2 46.36,53.98 | 43.34,54.77 44.69,54.77 45.12,55.2
  pour Bottom: 42.55,56.83 45.09,56.83 45.09,54.61 43.5,54.61 42.55,55.56
ISENS1
  Top 0.762: R16.2 R15.P$2
  Top 0.813: 37.47,41.59 37.47,42.55 40.01,45.09 R15.P$2 43.81,44.88 | 37.47,41.59 37.47,40.96 | 37.47,40.96 37.47,40.32 | J1.10 36.2,31.75 37.47,33.02 37.47,40.16 37.47,40.32 | Z1.C 38.1,40.96 | 38.1,40.96 37.47,40.96 | 38.1,40.96 37.47,41.59 | 38.1,40.96 37.47,40.32
  Bottom 1.016: J3.10 J1.10
L  (via drill 1.02 pad 2.03)  (1 unrouted)
  Bottom 1.27: 7.62,48.9 R8.P$2 | 7.62,48.9 7.62,50.48 | 7.62,50.48 16.03,58.9 J8.2 | HLK1.P$2 7.21,33.12 3.81,36.51 v3.81,43.81 | 7.62,50.48 6.03,48.9 | 6.03,48.9 3.81,46.67 v3.81,46.35 | 7.62,48.9 6.03,48.9
  pour Bottom: 5.4,34.92 14.92,34.92 16.83,33.02 7.3,33.02
  pour Bottom (no thermals, hatched): 15.56,59.05 17.46,59.05 17.46,61.59 15.56,61.59
  pour Top (no thermals, hatched): 17.46,59.05 15.56,59.05 15.56,61.59 17.46,61.59
N
  Bottom 1.016: ZMPT101B.1 18.26,38.73
  Bottom 1.27: J8.1 21.59,57.31 18.26,53.98 18.26,38.73 18.26,37.04 21.55,33.75 HLK1.P$1
  pour Bottom (no thermals, hatched): 22.54,59.05 20.64,59.05 20.64,61.59 22.54,61.59
  pour Top (no thermals, hatched): 20.64,59.05 20.64,61.59 22.54,61.59 22.54,59.05
N$8
  Bottom 1.016: ZMPT101B.4 14.05,45.16 7.62,38.73 R8.P$1
RX0
  Bottom 1.016: J2.4 J6.12
RX2
  Bottom 1.016: J2.10 J6.6
TX0
  Bottom 1.016: J2.3 J6.13
TX2
  Bottom 1.016: J2.9 J6.7
VCCA  (via drill 0.8 pad 2.03)
  Top 1.016: v55.88,20.95 55.56,20.64 50.59,20.64 | 50.59,20.64 50.53,20.59 48.9,20.59 47.62,19.32 FB1.1 | 50.59,20.64 48.88,22.35 | 48.88,22.35 C14.+ | 48.88,22.35 48.88,20.67
  Bottom 0.813: U1.8 51.82,41.53 51.75,41.59 | C8.1 C9.1 | 46.23,41.78 C9.1 | C9.1 C7.1 | 50.8,42.55 52.07,42.55
  Bottom 1.016: 57.47,34.29 55.56,36.2 | 57.47,34.29 57.47,22.54 v55.88,20.95 | 54.61,36.2 53.34,36.2 | 53.34,36.2 U1.8 52.07,36.45 | 55.56,36.2 54.13,37.62 | 54.13,37.62 52.07,39.69 | 52.07,41.27 51.75,41.59 | 51.75,41.59 50.8,42.55 46.99,42.55 46.23,41.78 C7.1 | 52.07,39.69 52.07,40.96 | 52.07,39.69 52.07,38.1 | 52.07,38.1 52.07,36.45 | 55.56,36.2 54.61,36.2 | 52.7,38.1 53.34,37.47 | 53.34,37.47 54.61,36.2 | 52.07,38.1 52.7,38.1 | 54.13,37.62 52.55,37.62 52.07,38.1 | 53.34,36.2 53.34,36.83 | 53.34,36.83 53.34,37.47 | 52.7,38.1 52.7,37.47 53.34,36.83 | 53.34,36.83 52.45,36.83 52.07,36.45 | 57.47,35.56 57.47,34.29 | 57.47,35.56 55.88,37.15 | 55.88,37.15 54.13,38.89 | 54.13,38.89 52.86,40.16 | 52.39,40.64 52.07,40.96 | 52.07,40.96 52.07,41.27 | 57.47,36.51 57.47,35.56 | 52.07,41.27 54.61,38.73 | 54.61,38.73 55.25,38.1 | 55.25,38.1 55.56,37.78 | 55.56,37.78 56.83,36.51 57.47,36.51 | 52.07,42.55 57.15,42.55 57.31,42.39 | 57.31,42.39 57.47,42.23 57.47,41.27 | 57.47,41.27 57.47,40.32 | 57.47,40.32 57.47,38.73 | 57.47,38.73 57.47,36.51 | 57.31,42.39 56.36,41.43 | 56.36,41.43 55.72,40.8 | 55.72,40.8 54.13,39.21 54.13,38.89 | 57.47,41.27 56.36,40.16 | 56.36,40.16 54.93,38.73 54.61,38.73 | 57.47,40.32 56.52,39.37 | 56.52,39.37 55.25,38.1 | 57.47,38.73 55.88,37.15 | 56.52,39.37 56.52,37.47 | 56.52,37.47 56.83,37.15 | 56.52,37.47 56.2,37.78 55.56,37.78 | 56.36,41.43 56.2,41.59 51.75,41.59 | 52.39,40.64 52.55,40.8 55.72,40.8 | 56.36,40.16 52.86,40.16 | 52.86,40.16 52.39,40.64
VIN  (via drill 0.8 pad 2.03)
  Top 0.762: 47.62,13.97 v47.62,13.34
  Top 1.016: FB1.2 v47.62,13.34
  Bottom 0.508: C12.+ 6.17,8.91 6.35,8.73 | C12.+ 32.37,8.91 J3.1 | HLK1.P$4 9.22,3.71 6.83,6.11 | 6.83,6.11 5.24,7.7 | C12.+ 4.45,6.75 5.08,6.11 6.83,6.11
  Bottom 0.762: 37.34,8.89 C3.1 | C1.1 29.34,8.89 | C2.1 44,8.76 46.36,11.11
  Bottom 1.016: C3.1 C2.1 | v47.62,13.34 47.62,12.38 46.36,11.11 | 46.36,11.11 44.13,8.89 | 44.13,8.89 J1.1 | 44.13,8.89 J9.1 46.36,11.11
  Bottom 1.27: J1.1 J3.1 32.26,8.76 C1.1 26.35,8.76 21.31,3.71 HLK1.P$4 9.64,3.71
  Bottom 1.397: C12.+ 4.45,8.89
  pour Bottom: 4.45,8.89 27.54,8.89 27.62,8.81 22.15,3.33 11.83,3.33 11.51,3.65 9.29,3.65 6.83,6.11 4.45,6.11
  pour Bottom (isolate 0.508): 4.45,7.3 4.45,1.59 5.4,0.64 19.69,0.64 27.3,8.26 6.03,8.26 5.08,7.3
VN
  Bottom 1.016: J3.13 J1.13
VP
  Bottom 1.016: J1.14 J3.14
VSENS  (via drill 0.8 pad 2.03)
  Top 0.762: R6.1 R5.P$1
  Top 0.813: R9.1 R7.P$1 | v40.01,36.67 41.75,38.42 45.09,38.42 47.62,35.88 47.62,30.8 49.85,28.57 U1.5
  Bottom 0.813: R5.P$1 40.01,24.13 42.7,21.43 50.07,21.43 51.75,23.11 U1.5
  Bottom 1.016: v40.01,36.67 37.47,39.21 37.47,46.04 35.72,47.78 32.23,47.78 R7.P$1 31.75,47.62 29.05,44.93 29.05,43.74 ZMPT101B.2
VSENS1  (via drill 0.8 pad 2.03)
  Top 0.813: R14.1 R13.P$1 56.83,25.4 57.79,26.35 57.79,38.53 55.36,40.96 Z2.C | J1.9 36.2,29.21 37.62,27.78 37.62,23.02 v40.01,20.64
  Bottom 0.813: v40.01,20.64 40.96,19.68 50.96,19.68 55.25,23.97 R13.P$1
  Bottom 1.016: J1.9 J3.9
VSENS2
  Top 0.762: R13.P$2 R14.2
  Bottom 0.762: U1.7 U1.6 51.82,32.38 54.61,32.38 R13.P$2

### Text on the board
Bottom: ESP32 Energy Monitor
tPlace: SWITCH | EN | D23 | VP | SCL | VN | TX0 | O | RX0 | 35 | SDA | I | D19 | V | D18 | 25 | D5 | B | TX2 | 27 | RX2 | 14 | D4 | SDA | 12 | SCL | D2 | 13 | D15 | 3.3 | G | GND | GND | V | 3.3 | + | - | Vbat | C:/Users/Yusni Maulana/Desktop/awaw.bmp | C:/Users/Yusni Maulana/Desktop/awaw.bmp
bPlace: Please / Cover | Please / Cover | Please / Cover | Please / Cover | Please / Cover | Please / Cover | High / Voltage ! | Please / Cover | Please / Cover
tNames: Muhammad Yusni Maulana | Muhammad Yusni Maulana
bNames: Designed in Batu / Made in Indonesia | ESP32 Energy Monitor
tStop: Muhammad Yusni Maulana
bStop: Rev2 by Yusni
200bmp: C:/Users/Yusni Maulana/Desktop/awaw.bmp